# Altium project EEPROM_Programmer.PrjPcb
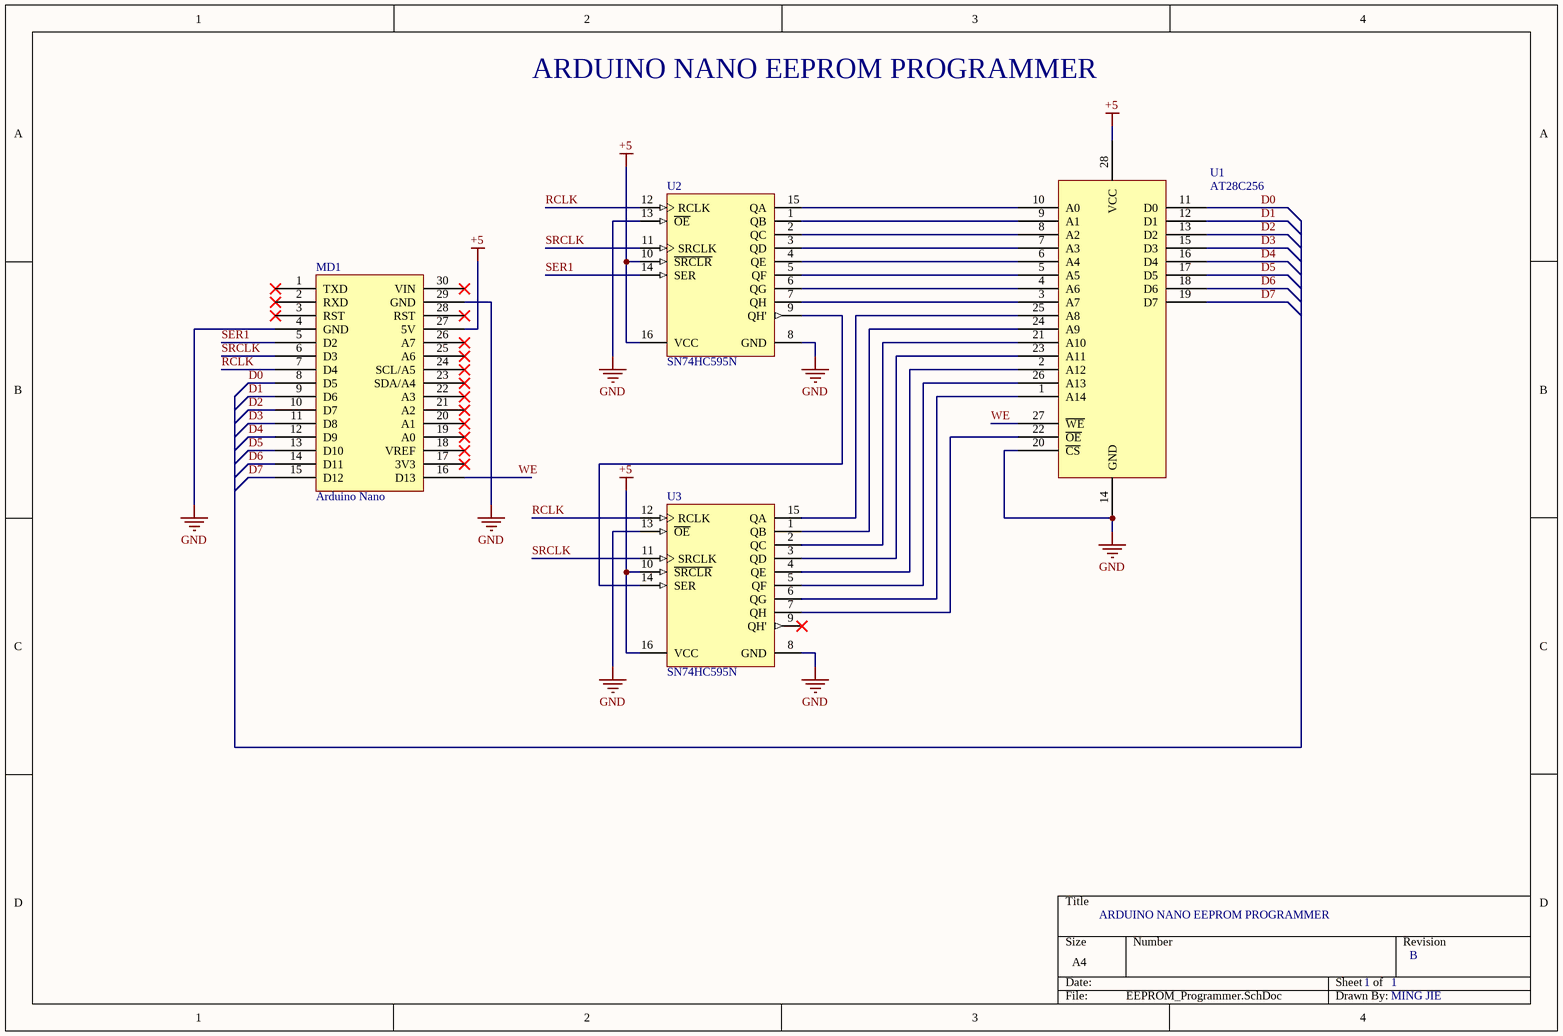
[diagram p0: EEPROM_Programmer.SchDoc]
1 sheet, 4 parts. Net scope: global (net labels, ports and power ports of the same name join across sheets).
Board file: EEPROM_Programmer.PcbDoc

## Sheet EEPROM_Programmer.SchDoc
size A4; SheetNumber: 1; SheetTotal: 1

### Parts
MD1  Arduino Nano  [ARDUINO_NANO]
U1  AT28C256  [DIP_28]
U2  SN74HC595N  [N0016A]
U3  SN74HC595N  [N0016A]

### Nets
+5: MD1.27(5V) U1.28(VCC) U2.10(~{SRCLR}) U2.16(VCC) U3.10(~{SRCLR}) U3.16(VCC)
GND: MD1.4(GND) MD1.29(GND) U1.14(GND) U1.20(~{CS}) U2.8(GND) U2.13(~{OE}) U3.8(GND) U3.13(~{OE})
D0: MD1.8(D5) U1.11(D0)
D1: MD1.9(D6) U1.12(D1)
D2: MD1.10(D7) U1.13(D2)
D3: MD1.11(D8) U1.15(D3)
D4: MD1.12(D9) U1.16(D4)
D5: MD1.13(D10) U1.17(D5)
D6: MD1.14(D11) U1.18(D6)
D7: MD1.15(D12) U1.19(D7)
RCLK: MD1.7(D4) U2.12(RCLK) U3.12(RCLK)
SER1: MD1.5(D2) U2.14(SER)
SRCLK: MD1.6(D3) U2.11(SRCLK) U3.11(SRCLK)
WE: MD1.16(D13) U1.27(~{WE})
NetU1_1: U1.1(A14) U3.6(QG)
NetU1_2: U1.2(A12) U3.4(QE)
NetU1_3: U1.3(A7) U2.7(QH)
NetU1_4: U1.4(A6) U2.6(QG)
NetU1_5: U1.5(A5) U2.5(QF)
NetU1_6: U1.6(A4) U2.4(QE)
NetU1_7: U1.7(A3) U2.3(QD)
NetU1_8: U1.8(A2) U2.2(QC)
NetU1_9: U1.9(A1) U2.1(QB)
NetU1_10: U1.10(A0) U2.15(QA)
NetU1_21: U1.21(A10) U3.2(QC)
NetU1_22: U1.22(~{OE}) U3.7(QH)
NetU1_23: U1.23(A11) U3.3(QD)
NetU1_24: U1.24(A9) U3.1(QB)
NetU1_25: U1.25(A8) U3.15(QA)
NetU1_26: U1.26(A13) U3.5(QF)
NetU2_9: U2.9(QH') U3.14(SER)

Not connected (* = marked no-connect by the designer): MD1 1(TXD)* 2(RXD)* 3(RST)* 17(3V3)* 18(VREF)* 19(A0)* 20(A1)* 21(A2)* 22(A3)* 23(SDA/A4)* 24(SCL/A5)* 25(A6)* 26(A7)* 28(RST)* 30(VIN)*; U3 9(QH')*

### Notes on the sheet
- ARDUINO NANO EEPROM PROGRAMMER
- 1
- B
- MING JIE

### Library data of the parts
MD1 = Arduino_Nano: Arduino Nano board
U1 = AT28C256: Paged Parallel EEPROM AT28C256
U2 U3 = CMP-0780-00137-3: 8-Bit Shift Registers With 3-State Output Registers, N0016A, TUBE; Manufacturer: Texas Instruments; F @ Nom Voltage(Max)(Mhz): 28; Input Type: CMOS; Bits: 8; VCC(Min)(V): 2; 3-State Output: Yes; ICC @ Nom Voltage(Max)(mA): 0.08; VCC(Max)(V): 6; tpd @ Nom Voltage(Max)(ns): 34; Rating: Military; Technology Family: HC; Output Drive (IOL/IOH)(Max)(mA): 7.8/-7.8; Code_JEDEC: MS-001; Output Type: CMOS; Operating Temperature Range(C): -40 to 85; Voltage(Nom)(V): 6; Generic Part Number: SN74HC595; DatasheetVersion: SCLS041H; PackageReference: N0016A; PackageVersion: http://www.ti.com/lit/ml/mpdi002c/mpdi002c.pdf